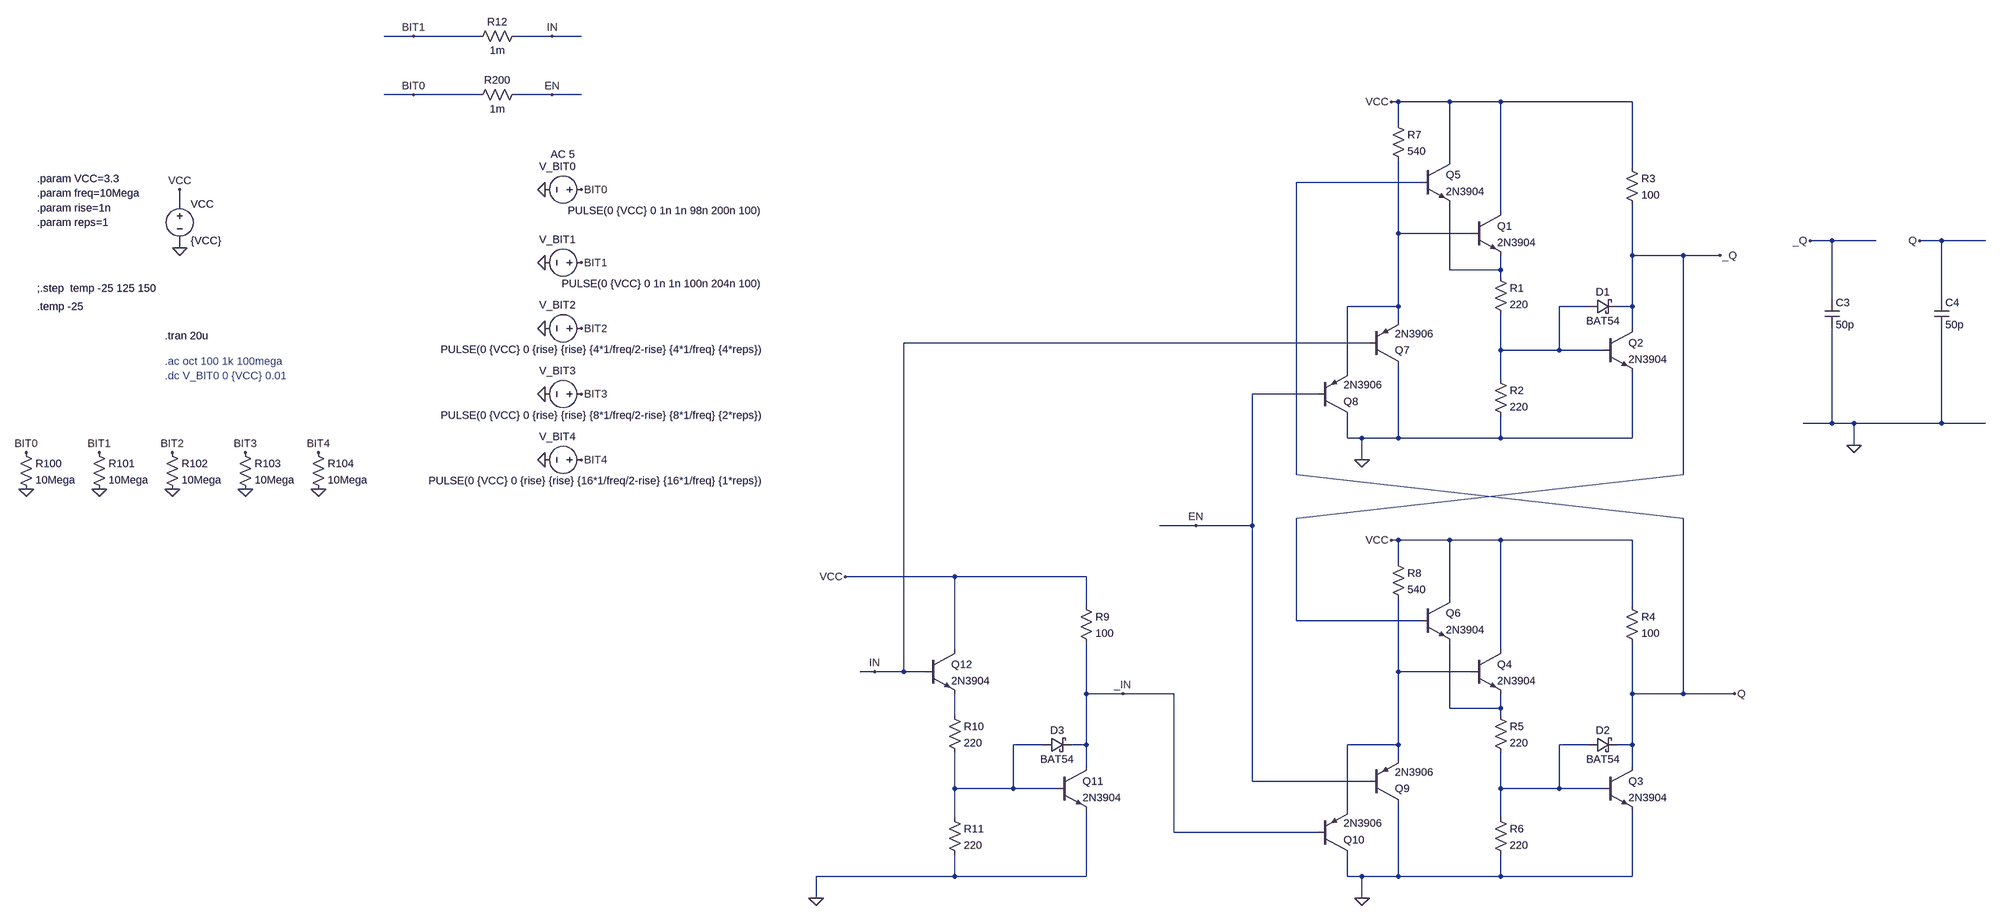
[diagram p0: schematic latch.asc]
latch.asc, the LTspice schematic file:
Version 4.1
SHEET 1 14868 10612
WIRE -240 544 -304 544
WIRE -96 544 -240 544
WIRE 64 544 -16 544
WIRE 128 544 64 544
WIRE -240 672 -304 672
WIRE -96 672 -240 672
WIRE 64 672 -16 672
WIRE 128 672 64 672
WIRE 2256 688 2240 688
WIRE 2368 688 2256 688
WIRE 2480 688 2368 688
WIRE 2768 688 2480 688
WIRE 2256 736 2256 688
WIRE 2368 816 2368 688
WIRE 2768 832 2768 688
WIRE 2304 864 2032 864
WIRE -752 912 -752 880
WIRE 2480 928 2480 688
WIRE 2256 976 2256 816
WIRE 2416 976 2256 976
WIRE 4256 992 4208 992
WIRE 4352 992 4256 992
WIRE 4496 992 4448 992
WIRE 4592 992 4496 992
WIRE -752 1008 -752 992
WIRE 2768 1024 2768 912
WIRE 2880 1024 2768 1024
WIRE 2960 1024 2880 1024
WIRE 2368 1056 2368 912
WIRE 2480 1056 2480 1024
WIRE 2480 1056 2368 1056
WIRE 2480 1072 2480 1056
WIRE 4256 1120 4256 992
WIRE 4496 1120 4496 992
WIRE 2256 1136 2256 976
WIRE 2256 1136 2144 1136
WIRE 2672 1136 2608 1136
WIRE 2768 1136 2768 1024
WIRE 2768 1136 2736 1136
WIRE 2256 1168 2256 1136
WIRE 2768 1184 2768 1136
WIRE 2192 1216 1104 1216
WIRE 2480 1232 2480 1152
WIRE 2608 1232 2608 1136
WIRE 2608 1232 2480 1232
WIRE 2704 1232 2608 1232
WIRE 2144 1280 2144 1136
WIRE 2480 1296 2480 1232
WIRE 2080 1328 1936 1328
WIRE 4256 1392 4256 1184
WIRE 4256 1392 4192 1392
WIRE 4304 1392 4256 1392
WIRE 4496 1392 4496 1184
WIRE 4496 1392 4304 1392
WIRE 4592 1392 4496 1392
WIRE 2144 1424 2144 1376
WIRE 2176 1424 2144 1424
WIRE 2256 1424 2256 1264
WIRE 2256 1424 2176 1424
WIRE 2480 1424 2480 1376
WIRE 2480 1424 2256 1424
WIRE 2768 1424 2768 1280
WIRE 2768 1424 2480 1424
WIRE 4304 1440 4304 1392
WIRE 2176 1472 2176 1424
WIRE 2032 1504 2032 864
WIRE 2880 1504 2880 1024
WIRE 2032 1600 2880 1504
WIRE 2880 1600 2032 1504
WIRE 1744 1616 1664 1616
WIRE 1936 1616 1936 1328
WIRE 1936 1616 1744 1616
WIRE 2256 1648 2240 1648
WIRE 2368 1648 2256 1648
WIRE 2480 1648 2368 1648
WIRE 2768 1648 2480 1648
WIRE 2256 1696 2256 1648
WIRE 1216 1728 976 1728
WIRE 1504 1728 1216 1728
WIRE 2368 1776 2368 1648
WIRE 1504 1792 1504 1728
WIRE 2768 1792 2768 1648
WIRE 2032 1824 2032 1600
WIRE 2304 1824 2032 1824
WIRE 1216 1888 1216 1728
WIRE 2480 1888 2480 1648
WIRE 1040 1936 1008 1936
WIRE 1104 1936 1104 1216
WIRE 1104 1936 1040 1936
WIRE 1152 1936 1104 1936
WIRE 2256 1936 2256 1776
WIRE 2416 1936 2256 1936
WIRE 1504 1984 1504 1872
WIRE 1584 1984 1504 1984
WIRE 1696 1984 1584 1984
WIRE 2768 1984 2768 1872
WIRE 2880 1984 2880 1600
WIRE 2880 1984 2768 1984
WIRE 2992 1984 2880 1984
WIRE 2368 2016 2368 1872
WIRE 2480 2016 2480 1984
WIRE 2480 2016 2368 2016
WIRE 1216 2032 1216 1984
WIRE 2480 2032 2480 2016
WIRE 1408 2096 1344 2096
WIRE 1504 2096 1504 1984
WIRE 1504 2096 1472 2096
WIRE 2256 2096 2256 1936
WIRE 2256 2096 2144 2096
WIRE 2672 2096 2608 2096
WIRE 2768 2096 2768 1984
WIRE 2768 2096 2736 2096
WIRE 2256 2128 2256 2096
WIRE 1504 2144 1504 2096
WIRE 2768 2144 2768 2096
WIRE 1936 2176 1936 1616
WIRE 2192 2176 1936 2176
WIRE 1216 2192 1216 2112
WIRE 1344 2192 1344 2096
WIRE 1344 2192 1216 2192
WIRE 1440 2192 1344 2192
WIRE 2480 2192 2480 2112
WIRE 2608 2192 2608 2096
WIRE 2608 2192 2480 2192
WIRE 2704 2192 2608 2192
WIRE 2144 2240 2144 2096
WIRE 1216 2256 1216 2192
WIRE 2480 2256 2480 2192
WIRE 1696 2288 1696 1984
WIRE 2080 2288 1696 2288
WIRE 1216 2384 1216 2336
WIRE 1216 2384 912 2384
WIRE 1504 2384 1504 2240
WIRE 1504 2384 1216 2384
WIRE 2144 2384 2144 2336
WIRE 2176 2384 2144 2384
WIRE 2256 2384 2256 2224
WIRE 2256 2384 2176 2384
WIRE 2480 2384 2480 2336
WIRE 2480 2384 2256 2384
WIRE 2768 2384 2768 2240
WIRE 2768 2384 2480 2384
WIRE 912 2432 912 2384
WIRE 2176 2432 2176 2384
FLAG -752 1008 0
FLAG 128 880 BIT0
FLAG -752 880 VCC
FLAG 48 880 0
FLAG 128 1040 BIT1
FLAG 48 1040 0
FLAG 128 1184 BIT2
FLAG 48 1184 0
FLAG 128 1328 BIT3
FLAG 48 1328 0
FLAG 128 1472 BIT4
FLAG 48 1472 0
FLAG -1088 1456 BIT0
FLAG -1088 1536 0
FLAG -928 1456 BIT1
FLAG -928 1536 0
FLAG -768 1456 BIT2
FLAG -768 1536 0
FLAG -608 1456 BIT3
FLAG -608 1536 0
FLAG -448 1456 BIT4
FLAG -448 1536 0
FLAG 2176 1472 0
FLAG 2960 1024 _Q
FLAG 2240 688 VCC
FLAG -240 672 BIT0
FLAG 64 672 EN
FLAG 2176 2432 0
FLAG 2992 1984 Q
FLAG 2240 1648 VCC
FLAG 912 2432 0
FLAG 1040 1936 IN
FLAG 976 1728 VCC
FLAG 1584 1984 _IN
FLAG 1744 1616 EN
FLAG -240 544 BIT1
FLAG 64 544 IN
FLAG 4208 992 _Q
FLAG 4448 992 Q
FLAG 4304 1440 0
SYMBOL voltage -752 896 R0
WINDOW 123 0 0 Left 0
WINDOW 39 0 0 Left 0
SYMATTR InstName VCC
SYMATTR Value {VCC}
SYMBOL voltage 144 880 R90
WINDOW 123 -77 30 VRight 2
WINDOW 39 0 0 Left 0
WINDOW 0 -51 28 VRight 2
WINDOW 3 46 -379 VRight 2
SYMATTR Value2 AC 5
SYMATTR InstName V_BIT0
SYMATTR Value PULSE(0 {VCC} 0 1n 1n 98n 200n 100)
SYMBOL voltage 144 1040 R90
WINDOW 123 -77 30 VRight 2
WINDOW 39 0 0 Left 0
WINDOW 0 -51 28 VRight 2
WINDOW 3 46 -379 VRight 2
SYMATTR InstName V_BIT1
SYMATTR Value PULSE(0 {VCC} 0 1n 1n 100n 204n 100)
SYMBOL voltage 144 1184 R90
WINDOW 123 -77 30 VRight 2
WINDOW 39 0 0 Left 0
WINDOW 0 -51 28 VRight 2
WINDOW 3 46 -379 VRight 2
SYMATTR InstName V_BIT2
SYMATTR Value PULSE(0 {VCC} 0 {rise} {rise} {4*1/freq/2-rise} {4*1/freq} {4*reps})
SYMBOL voltage 144 1328 R90
WINDOW 123 -77 30 VRight 2
WINDOW 39 0 0 Left 0
WINDOW 0 -51 28 VRight 2
WINDOW 3 46 -379 VRight 2
SYMATTR InstName V_BIT3
SYMATTR Value PULSE(0 {VCC} 0 {rise} {rise} {8*1/freq/2-rise} {8*1/freq} {2*reps})
SYMBOL voltage 144 1472 R90
WINDOW 123 -77 30 VRight 2
WINDOW 39 0 0 Left 0
WINDOW 0 -51 28 VRight 2
WINDOW 3 46 -379 VRight 2
SYMATTR InstName V_BIT4
SYMATTR Value PULSE(0 {VCC} 0 {rise} {rise} {16*1/freq/2-rise} {16*1/freq} {1*reps})
SYMBOL res -1104 1440 R0
SYMATTR InstName R100
SYMATTR Value 10Mega
SYMBOL res -944 1440 R0
SYMATTR InstName R101
SYMATTR Value 10Mega
SYMBOL res -784 1440 R0
SYMATTR InstName R102
SYMATTR Value 10Mega
SYMBOL res -624 1440 R0
SYMATTR InstName R103
SYMATTR Value 10Mega
SYMBOL res -464 1440 R0
SYMATTR InstName R104
SYMATTR Value 10Mega
SYMBOL npn 2704 1184 R0
SYMATTR InstName Q2
SYMATTR Value 2N3904
SYMBOL schottky 2672 1152 R270
WINDOW 0 32 32 VTop 2
WINDOW 3 0 32 VBottom 2
SYMATTR InstName D1
SYMATTR Value BAT54
SYMATTR Description Diode
SYMATTR Type diode
SYMBOL npn 2416 928 R0
SYMATTR InstName Q1
SYMATTR Value 2N3904
SYMBOL res 2752 816 R0
SYMATTR InstName R3
SYMATTR Value 100
SYMBOL res 2464 1056 R0
SYMATTR InstName R1
SYMATTR Value 220
SYMBOL res 2464 1280 R0
SYMATTR InstName R2
SYMATTR Value 220
SYMBOL res 0 656 R90
WINDOW 0 0 56 VBottom 2
WINDOW 3 32 56 VTop 2
SYMATTR InstName R200
SYMATTR Value 1m
SYMBOL npn 2304 816 R0
SYMATTR InstName Q5
SYMATTR Value 2N3904
SYMBOL pnp 2192 1264 M180
SYMATTR InstName Q7
SYMATTR Value 2N3906
SYMBOL pnp 2080 1376 M180
SYMATTR InstName Q8
SYMATTR Value 2N3906
SYMBOL res 2240 720 R0
SYMATTR InstName R7
SYMATTR Value 540
SYMBOL npn 2704 2144 R0
SYMATTR InstName Q3
SYMATTR Value 2N3904
SYMBOL schottky 2672 2112 R270
WINDOW 0 32 32 VTop 2
WINDOW 3 0 32 VBottom 2
SYMATTR InstName D2
SYMATTR Value BAT54
SYMATTR Description Diode
SYMATTR Type diode
SYMBOL npn 2416 1888 R0
SYMATTR InstName Q4
SYMATTR Value 2N3904
SYMBOL res 2752 1776 R0
SYMATTR InstName R4
SYMATTR Value 100
SYMBOL res 2464 2016 R0
SYMATTR InstName R5
SYMATTR Value 220
SYMBOL res 2464 2240 R0
SYMATTR InstName R6
SYMATTR Value 220
SYMBOL npn 2304 1776 R0
SYMATTR InstName Q6
SYMATTR Value 2N3904
SYMBOL pnp 2192 2224 M180
SYMATTR InstName Q9
SYMATTR Value 2N3906
SYMBOL pnp 2080 2336 M180
SYMATTR InstName Q10
SYMATTR Value 2N3906
SYMBOL res 2240 1680 R0
SYMATTR InstName R8
SYMATTR Value 540
SYMBOL npn 1440 2144 R0
SYMATTR InstName Q11
SYMATTR Value 2N3904
SYMBOL schottky 1408 2112 R270
WINDOW 0 32 32 VTop 2
WINDOW 3 0 32 VBottom 2
SYMATTR InstName D3
SYMATTR Value BAT54
SYMATTR Description Diode
SYMATTR Type diode
SYMBOL npn 1152 1888 R0
SYMATTR InstName Q12
SYMATTR Value 2N3904
SYMBOL res 1488 1776 R0
SYMATTR InstName R9
SYMATTR Value 100
SYMBOL res 1200 2016 R0
SYMATTR InstName R10
SYMATTR Value 220
SYMBOL res 1200 2240 R0
SYMATTR InstName R11
SYMATTR Value 220
SYMBOL res 0 528 R90
WINDOW 0 0 56 VBottom 2
WINDOW 3 32 56 VTop 2
SYMATTR InstName R12
SYMATTR Value 1m
SYMBOL cap 4240 1120 R0
SYMATTR InstName C3
SYMATTR Value 50p
SYMBOL cap 4480 1120 R0
SYMATTR InstName C4
SYMATTR Value 50p
TEXT -784 1200 Left 2 !.tran 20u
TEXT -784 1256 Left 2 ;.ac oct 100 1k 100mega
TEXT -784 1288 Left 2 ;.dc V_BIT0 0 {VCC} 0.01
TEXT -1064 856 Left 2 !.param VCC=3.3
TEXT -1064 888 Left 2 !.param freq=10Mega
TEXT -1064 920 Left 2 !.param rise=1n
TEXT -1064 952 Left 2 !.param reps=1
TEXT -1064 1096 Left 2 !;.step  temp -25 125 150
TEXT -1064 1136 Left 2 !.temp -25

The netlist it stands for:
* latch.asc
VCC VCC 0 {VCC}
V_BIT0 BIT0 0 PULSE(0 {VCC} 0 1n 1n 98n 200n 100) AC 5
V_BIT1 BIT1 0 PULSE(0 {VCC} 0 1n 1n 100n 204n 100)
V_BIT2 BIT2 0 PULSE(0 {VCC} 0 {rise} {rise} {4*1/freq/2-rise} {4*1/freq} {4*reps})
V_BIT3 BIT3 0 PULSE(0 {VCC} 0 {rise} {rise} {8*1/freq/2-rise} {8*1/freq} {2*reps})
V_BIT4 BIT4 0 PULSE(0 {VCC} 0 {rise} {rise} {16*1/freq/2-rise} {16*1/freq} {1*reps})
R100 BIT0 0 10Mega
R101 BIT1 0 10Mega
R102 BIT2 0 10Mega
R103 BIT3 0 10Mega
R104 BIT4 0 10Mega
Q2 _Q N003 0 0 2N3904
D1 N003 _Q BAT54
Q1 VCC N001 N002 0 2N3904
R3 VCC _Q 100
R1 N002 N003 220
R2 N003 0 220
R200 EN BIT0 1m
Q5 VCC Q N002 0 2N3904
Q7 0 IN N001 0 2N3906
Q8 0 EN N001 0 2N3906
R7 VCC N001 540
Q3 Q N008 0 0 2N3904
D2 N008 Q BAT54
Q4 VCC N004 N005 0 2N3904
R4 VCC Q 100
R5 N005 N008 220
R6 N008 0 220
Q6 VCC _Q N005 0 2N3904
Q9 0 EN N004 0 2N3906
Q10 0 _IN N004 0 2N3906
R8 VCC N004 540
Q11 _IN N007 0 0 2N3904
D3 N007 _IN BAT54
Q12 VCC IN N006 0 2N3904
R9 VCC _IN 100
R10 N006 N007 220
R11 N007 0 220
R12 IN BIT1 1m
C3 _Q 0 50p
C4 Q 0 50p
.model D D
.lib standard.dio
.model NPN NPN
.model PNP PNP
.lib standard.bjt
.tran 20u
* .ac oct 100 1k 100mega
* .dc V_BIT0 0 {VCC} 0.01
.param VCC=3.3
.param freq=10Mega
.param rise=1n
.param reps=1
;.step  temp -25 125 150
.temp -25
.backanno
.end